# Altium schematic sheet Light.SchDoc
size A4
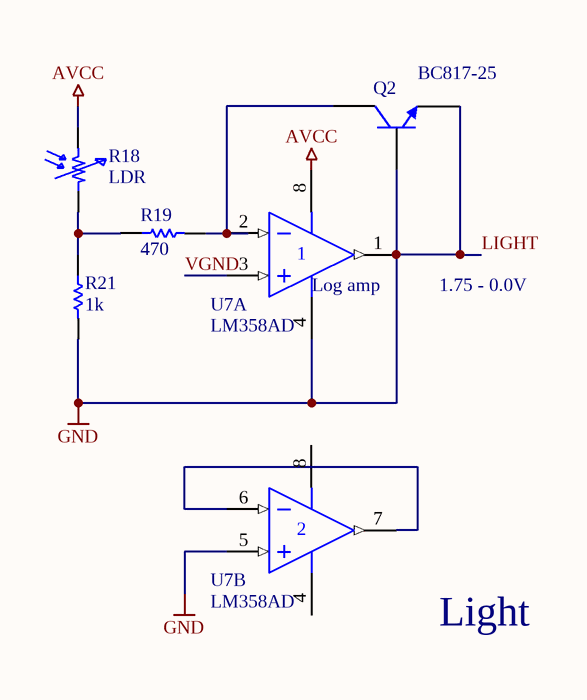
[diagram p0: Light.SchDoc]

## Parts
Q2  BC817-25  [SOT23_N]
R18  LDR  [KE-10720]
R19  470  [6-0805]
R21  1k  [6-0805]
U7  LM358AD  [SOIC127P600X175-8AN]  (parts A,B of 2)

## Nets
AVCC: R18.1 U7.8(V+)
LIGHT: Q2.1(B) Q2.2(E) R21.2 U7.1(OUT) U7.4(V-) U7.5(IN+)  [also labelled GND]
VGND: U7.3(IN+)
NetQ2_3: Q2.3(C) R19.2 U7.2(IN-)
NetR18_2: R18.2 R19.1 R21.1
NetU7_6: U7.6(IN-) U7.7(OUT)

## Notes on the sheet
- (near U7) Log amp
- 1.75 - 0.0V
- Light

## Library data of the parts
Q2 = BC817-25: NPN General Purpose Amplifier; Published: 8-Jun-2000; LatestRevisionDate: 20-Nov-2009; LatestRevisionNote: IPC-7351 Footprint Added.; DatasheetVersion: 1997; PackageVersion: Sep-1998; PackageReference: SOT-23A; Publisher: Altium Limited; PackageDescription: 3-Pin SOT-23 Package 0.95 mm Pitch, 2.3 mm Lead Span; ComponentLink1Description: Manufacturer Link; ComponentLink1URL: http://www.fairchildsemi.com/; ComponentLink2Description: Discontinuation Notice; ComponentLink2URL: http://www.fairchildsemi.com/obsolete/obs.jsp
R18 = LDR: KE-10720
R19 R21 = ERJ6RB: Precision Thick Film Chip Resistor, 10 Ohm to 1M Ohm Range, 1% and 0.5% Tolerance, 0805 Size, 0.1 W; Published: 17-Dec-2003; LatestRevisionDate: 19-Mar-2004; LatestRevisionNote: Silkscreen size reduced.; PackageDocument: Mar-2003; PackageReference: 6-0805; Publisher: Altium Limited; Code_IPC: 2012 [0805]; ComponentLink1Description: Manufacturer Link; ComponentLink1URL: http://www.panasonic.com/industrial/components/resistive_products.htm; ComponentLink2Description: Datasheet; ComponentLink2URL: http://www.panasonic.com/industrial/components/pdf/AOA0000CE2.pdf
U7 = LM358AD: Dual Operational Amplifier; Published: 15-Apr-2002; LatestRevisionDate: 13-Apr-2006; LatestRevisionNote: IPC-7351 Footprint Added.; DatasheetVersion: Aug-1988; PackageVersion: Jan-1998; PackageReference: D008; Publisher: Altium Limited; PackageDescription: 8-Pin Small Outline Integrated Circuit 1.27 mm Pitch; Code_IPC: SOIC127P600-8; ComponentLink1Description: Manufacturer Link; ComponentLink1URL: http://www.ti.com/; ComponentLink2Description: Datasheet; ComponentLink2URL: http://www-s.ti.com/sc/ds/lm358.pdf